# EAGLE design v1 (EAGLE 8.4.1)
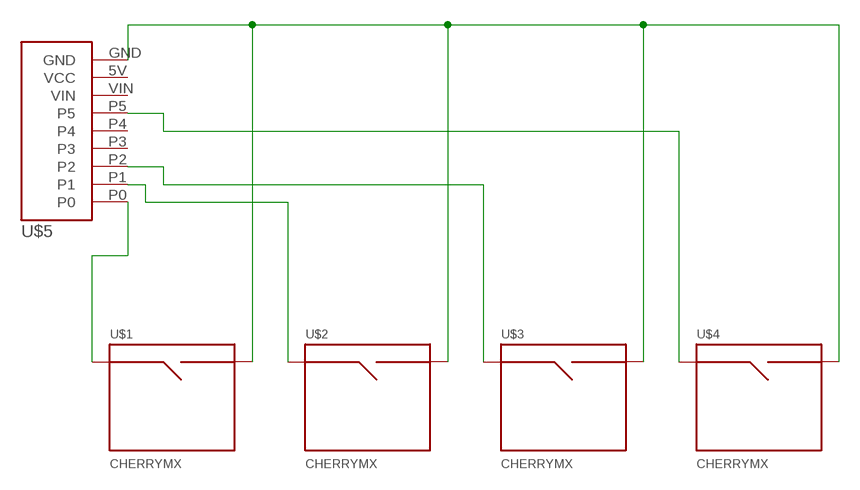
[diagram p0: schematic, sheet 1]

## Parts
U$1  CHERRYMX  [CHERRYMX]
U$2  CHERRYMX  [CHERRYMX]
U$3  CHERRYMX  [CHERRYMX]
U$4  CHERRYMX  [CHERRYMX]
U$5  ATTINY85  [ATTINY85]

## Nets
GND: U$1.P$2(SIG2) U$2.P$2(SIG2) U$3.P$2(SIG2) U$4.P$2(SIG2) U$5.GND
N$2: U$1.P$1(SIG1) U$5.P0
N$3: U$2.P$1(SIG1) U$5.P1
N$4: U$3.P$1(SIG1) U$5.P2
N$5: U$4.P$1(SIG1) U$5.P5
Unconnected: U$5.5V(VCC) U$5.P3 U$5.P4 U$5.VIN

## Library data of the parts
U$1-U$4 = GardnerCustom:CHERRYMX
U$5 = GardnerCustom:ATTINY85

## Board
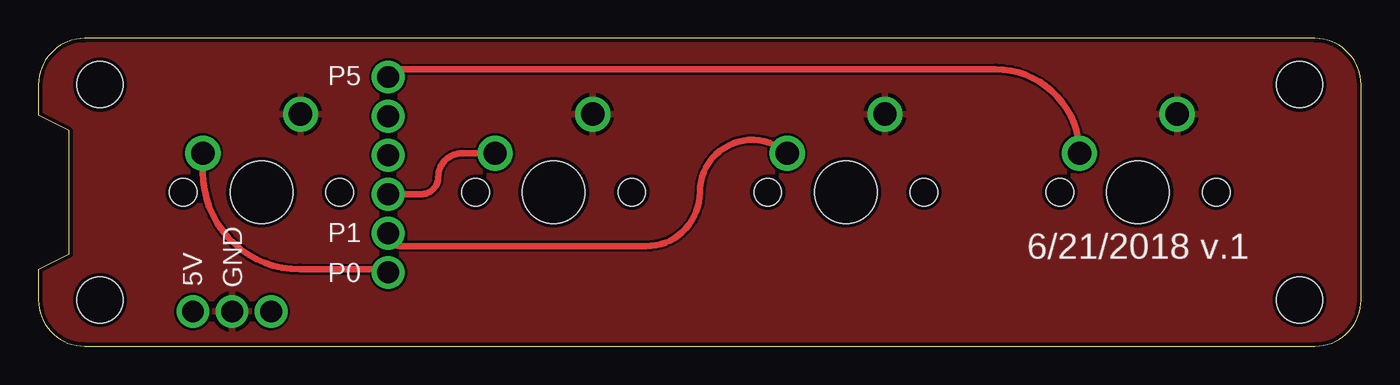
[diagram p1: board, top side]
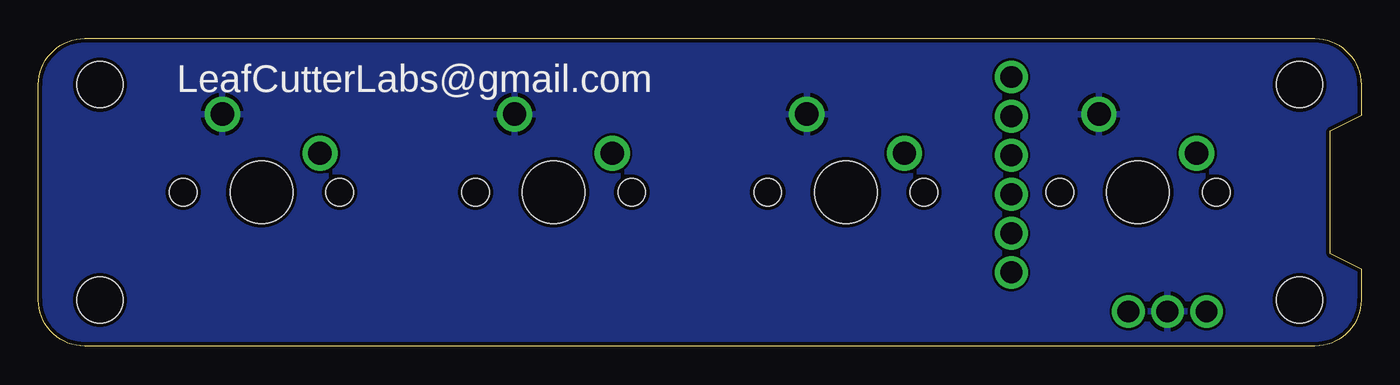
[diagram p2: board, bottom side, seen from below]

Size 86 x 20 mm. Coordinates in mm from the lower left corner, seen from the top.
Outline: 3,0 83,0 arc90 86,3 86,17 arc90 83,20 3,20 arc90 0,17 0,15 2,14 2,6 0,5 0,3 arc90 3,0
Copper layers (1*16): Top 0.035mm / dielectric 1.5mm / Bottom 0.035mm
Design rules "SeeedStudio_2layer_DRU_no_angle_20140221 *": minimum track width 6mil, minimum drill 12mil, track to track 6mil, track to pad 6mil, pad to pad 6mil, via to via 6mil, smd to smd 0mil, copper to edge 10mil, drill to drill 10mil, minimum pad ring 10mil, minimum via ring 6mil, stop-mask expansion 2mil, vias tented up to drill 100mil, thermal gap 10mil
Holes 3 mm at 82,17 82,3

### Footprints (pad centres in the part's own frame; a part is rotated, then mirrored left to right if it is on the bottom)
CHERRYMX = drill 1.524: P$1 -3.81,2.54; P$2 2.54,5.08 | hole 4.064: 0,0 | hole 1.778: -5.08,0; 5.08,0
ATTINY85 = drill 1.422: 5V 6.045,-7.747; GND 8.585,-7.747; P0 18.745,-5.207; P1 18.745,-2.667; P2 18.745,-0.127; P3 18.745,2.413; P4 18.745,4.953; P5 18.745,7.493; VIN 11.125,-7.747 | hole 3: 0,7; 0,-7

### Placement (x,y rotation side)
U$1  14.5,10 0 top
U$2  52.5,10 0 top
U$3  33.5,10 0 top
U$4  71.5,10 0 top
U$5  4,10 0 top

### Tracks (layer width: path | path; a pad name or v marks a point on that pad's centre or on a via)
GND
  pour Top: 0,0 86,0 86,20 0,20
  pour Bottom: 0,0 86,0 86,20 0,20
N$2
  Top 0.406: U$1.P$1 10.69,11.31 arc90 17,5 22.54,5 arc-90 U$5.P0
N$3
  Top 0.406: U$2.P$1 arc132 43,10 arc-90 39.5,6.5 24,6.5 | 24,6.5 23.6,6.5 | 24,6.5 23.58,6.5 arc-90 U$5.P1
N$4
  Top 0.406: U$5.P2 24.87,9.87 arc90 26,11 arc-90 27.54,12.54 U$3.P$1
N$5
  Top 0.406: U$5.P5 arc-90 23.25,18 62.23,18 arc-90 U$4.P$1

### Text on the board
tPlace: P5 | P1 | 6/21/2018 v.1 | P0 | 5V | GND
bPlace: LeafCutterLabs@gmail.com
bStop: miniMACROPAD